# Altium project lan9254.PrjPcb (part 2 of 5)

## Sheet Page 04-LAN9254-Part1.SchDoc
size 416 x 264 mm; DrawnBy: Xuelu Li; Engineer: Parthiv/Xuelu; DocumentNumber: 4; Revision: A0; SheetNumber: 4; SheetTotal: 8; PageSetup: Record=PageOptions|CenterHorizontal=True|CenterVertical=True|PrintScale=1.02|XCorrection=1.00|YCorrection=1.00|PrintKind=0|BorderSize=5000000|LeftOffset=0|BottomOffset=0|Orientation=2|PaperLength=1000|PaperWidth=1000|Scale=100|PaperSource=15|PrintQuality=600|MediaType=1|DitherType=10|PrintScaleMode=1|PaperKind=11x17|PaperIndex=17; PageTitle: LAN9254-Page1; ProjName: EVB-LAN9254-DIGIO; DesignDescription: LAN9254 Evaluation Board; Designer: Xuelu Li; PartNumber: EVB-LAN9254-DIGIO; Sheet1Title: LAN9254-Page1; DocumentFullPathAndName: //depot_np_hweng_boards/ung_hweng/UNG_8017_EVB-USB5926/; ProjectName: lan9254.PrjPcb
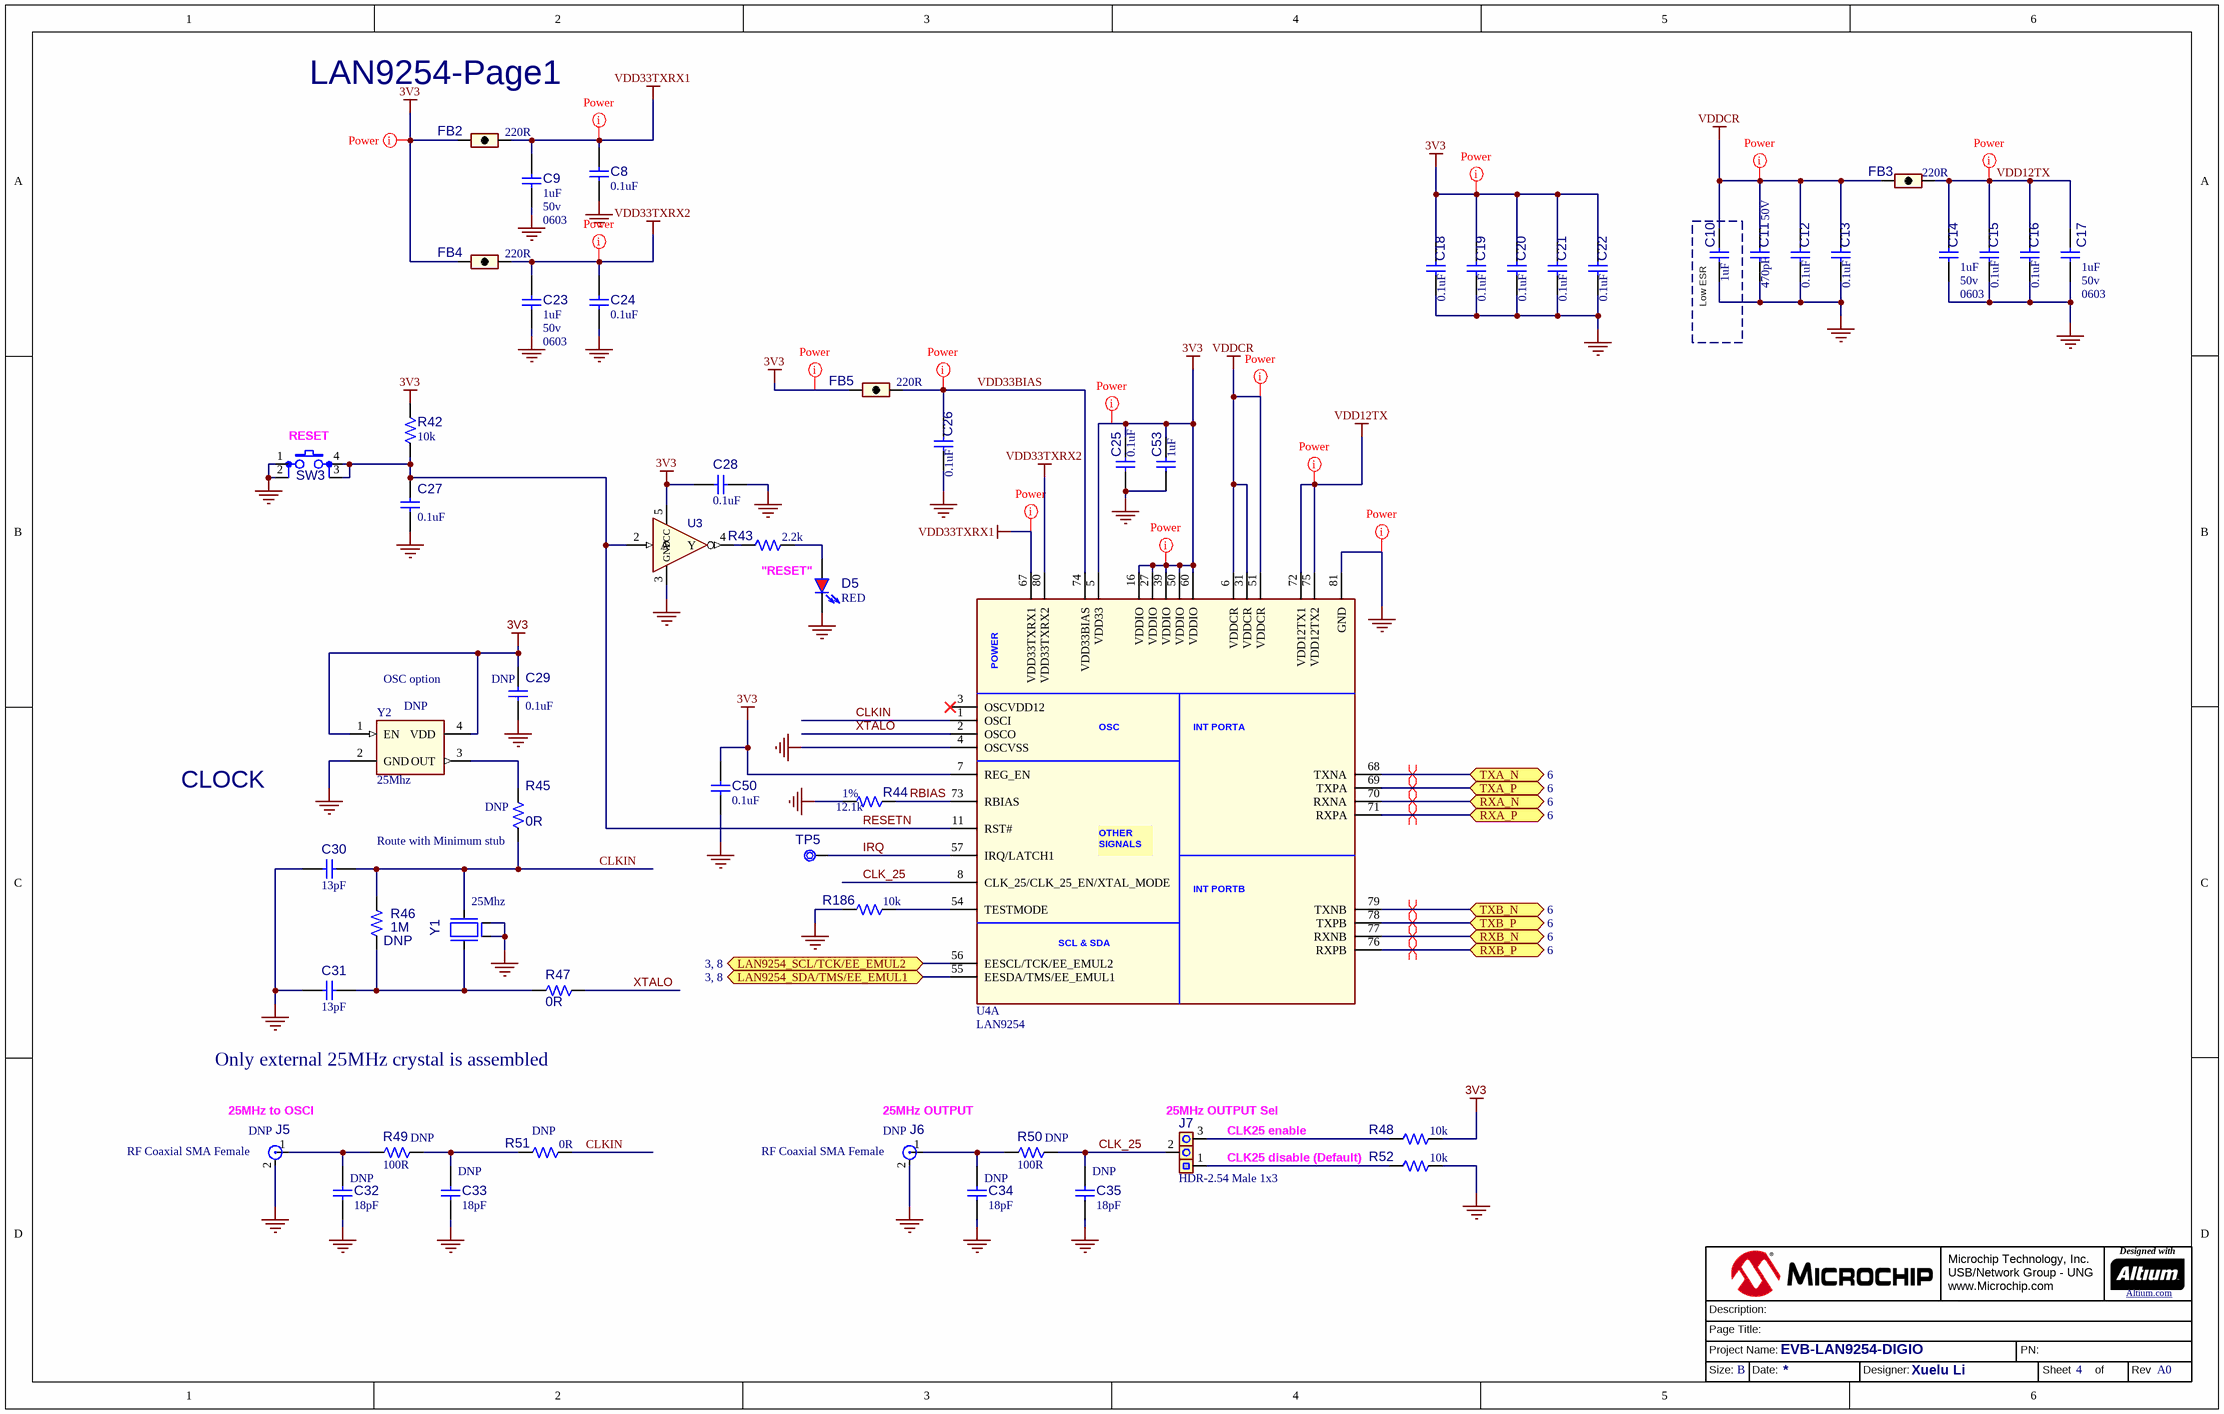
[diagram p3: Page 04-LAN9254-Part1.SchDoc]

### Parts
(Parts that share a designator on the sheet are numbered #1, #2 ... from top to bottom, then left to right.)
?#4  (no value)  (graphical)
C8  value 0.1uF  [CAP_C_0402]  (hidden comment: Capacitor NP)
C9  value 1uF  Voltage: 50v  Package: 0603  [CAP_C_0603]  (hidden comment: Capacitor NP)
C10  value 1uF  [CAP_C_0603]  (hidden comment: Capacitor NP)
C11  value 470pF  Voltage: 50V  [CAP_C_0402]  (hidden comment: Capacitor NP)
C12  value 0.1uF  [CAP_C_0402]  (hidden comment: Capacitor NP)
C13  value 0.1uF  [CAP_C_0402]  (hidden comment: Capacitor NP)
C14  value 1uF  Voltage: 50v  Package: 0603  [CAP_C_0603]  (hidden comment: Capacitor NP)
C15  value 0.1uF  [CAP_C_0402]  (hidden comment: Capacitor NP)
C16  value 0.1uF  [CAP_C_0402]  (hidden comment: Capacitor NP)
C17  value 1uF  Voltage: 50v  Package: 0603  [CAP_C_0603]  (hidden comment: Capacitor NP)
C18  value 0.1uF  [CAP_C_0402]  (hidden comment: Capacitor NP)
C19  value 0.1uF  [CAP_C_0402]  (hidden comment: Capacitor NP)
C20  value 0.1uF  [CAP_C_0402]  (hidden comment: Capacitor NP)
C21  value 0.1uF  [CAP_C_0402]  (hidden comment: Capacitor NP)
C22  value 0.1uF  [CAP_C_0402]  (hidden comment: Capacitor NP)
C23  value 1uF  Voltage: 50v  Package: 0603  [CAP_C_0603]  (hidden comment: Capacitor NP)
C24  value 0.1uF  [CAP_C_0402]  (hidden comment: Capacitor NP)
C25  value 0.1uF  [CAP_C_0402]  (hidden comment: Capacitor NP)
C26  value 0.1uF  [CAP_C_0402]  (hidden comment: Capacitor NP)
C27  value 0.1uF  [CAP_C_0402]  (hidden comment: Capacitor NP)
C28  value 0.1uF  [CAP_C_0402]  (hidden comment: Capacitor NP)
C29  value 0.1uF  Populated: DNP  [CAP_C_0402]  (hidden comment: Capacitor NP)
C30  value 13pF  [CAP_C_0603]  (hidden comment: Capacitor NP)
C31  value 13pF  [CAP_C_0603]  (hidden comment: Capacitor NP)
C32  value 18pF  Populated: DNP  [CAP_C_0805]  (hidden comment: Capacitor NP)
C33  value 18pF  Populated: DNP  [CAP_C_0805]  (hidden comment: Capacitor NP)
C34  value 18pF  Populated: DNP  [CAP_C_0805]  (hidden comment: Capacitor NP)
C35  value 18pF  Populated: DNP  [CAP_C_0805]  (hidden comment: Capacitor NP)
C50  value 0.1uF  [CAP_C_0402]  (hidden comment: Capacitor NP)
C53  value 1uF  [CAP_C_0603]  (hidden comment: Capacitor NP)
D5  value RED  [LED_0603_RED]  (hidden comment: LED_red)
FB2  value 220R  [IND_C_0603]  (hidden comment: Ferrite Bead)
FB3  value 220R  [IND_C_0603]  (hidden comment: Ferrite Bead)
FB4  value 220R  [IND_C_0603]  (hidden comment: Ferrite Bead)
FB5  value 220R  [IND_C_0603]  (hidden comment: Ferrite Bead)
J5  value RF Coaxial SMA Female  Populated: DNP  [CON_JACK_F_TH_V_ACP_901-144-8RFX]  (hidden comment: CON Jack 2 Pins)
J6  value RF Coaxial SMA Female  Populated: DNP  [CON_JACK_F_TH_V_ACP_901-144-8RFX]  (hidden comment: CON Jack 2 Pins)
J7  value HDR-2.54 Male 1x3  [HDR_M_2.54_1x3]  (hidden comment: Header 1x3)
R42  value 10k  [RES_C_0603]  (hidden comment: Resistor)
R43  value 2.2k  [RES_C_0603]  (hidden comment: Resistor)
R44  value 12.1k  Tolerance: 1%  [RES_C_0603]  (hidden comment: Resistor)
R45  value 0R  Populate: DNP  [RES_C_0603]  (hidden comment: Resistor)
R46  value 1M  Populated: DNP  [RES_C_0603]  (hidden comment: Resistor)
R47  value 0R  [RES_C_0603]  (hidden comment: Resistor)
R48  value 10k  [RES_C_0603]  (hidden comment: Resistor)
R49  value 100R  Populated: DNP  [RES_C_0805]  (hidden comment: Resistor)
R50  value 100R  Populated: DNP  [RES_C_0805]  (hidden comment: Resistor)
R51  value 0R  Populated: DNP  [RES_C_0402]  (hidden comment: Resistor)
R52  value 10k  [RES_C_0603]  (hidden comment: Resistor)
R186  value 10k  [RES_C_0603]  (hidden comment: Resistor)
SW3  Switch 4 Pin  [SW_TACT_SMD_CK_PTS810SJM]  (value not drawn)
TP5  Test Point No BOM  [TP_1.2x0.7]  (value not drawn)  (no BOM)
U3  74AHC1G14 SC-70-5  [SC-70-5]  (value not drawn)
U4  value LAN9254  [TQFP-80_12x12_EP6x6]  (hidden comment: LAN9254-SVB TQFP80)  (part A of 2)
Y1  value 25Mhz  [CRYSTAL_XRCGB_L2W1.6H0.7]  (hidden comment: Crystal 4 Pins)
Y2  value 25Mhz  Populated: DNP  [OSCILLATOR_KC2520B-C1]  (hidden comment: OSCILLATOR 4 Pins)

### Blocks framed on the sheet
Low ESR: C10

### Ports
LAN9254_SCL/TCK/EE_EMUL2 (bidir, see 3, 8), LAN9254_SDA/TMS/EE_EMUL1 (bidir, see 3, 8), RXA_N (bidir, see 6), RXA_P (bidir, see 6), RXB_N (bidir, see 6), RXB_P (bidir, see 6), TXA_N (bidir, see 6), TXA_P (bidir, see 6), TXB_N (bidir, see 6), TXB_P (bidir, see 6)

### Nets
3V3: C18.2 C19.2 C20.2 C21.2 C22.2 C25.2 C28.2 C29.2 C50.1 C53.2 FB2.1 FB4.1 FB5.1 R42.1 R48.1 U3.5(VCC) U4.5(VDD33) U4.7(REG_EN) U4.16(VDDIO) U4.27(VDDIO) U4.39(VDDIO) U4.50(VDDIO) U4.60(VDDIO) Y2.1(EN) Y2.4(VDD)
GND: C8.2 C9.1 C10.1 C11.1 C12.1 C13.1 C14.1 C15.1 C16.1 C17.1 C18.1 C19.1 C20.1 C21.1 C22.1 C23.1 C24.2 C25.1 C26.1 C27.1 C28.1 C29.1 C30.1 C31.1 C32.1 C33.1 C34.1 C35.1 C50.2 C53.1 D5.2(K) J5.2 J6.2 R44.1 R52.1 R186.2 SW3.1 SW3.2 U3.3(GND) U4.4(OSCVSS) U4.81(GND) Y1.2(GND) Y1.4(GND) Y2.2(GND)
VDD12TX: C14.2 C15.2 C16.2 C17.2 FB3.2 U4.72(VDD12TX1) U4.75(VDD12TX2)
VDD33TXRX1: C8.1 C9.2 FB2.2 U4.67(VDD33TXRX1)
VDD33TXRX2: C23.2 C24.1 FB4.2 U4.80(VDD33TXRX2)
VDDCR: C10.2 C11.2 C12.2 C13.2 FB3.1 U4.6(VDDCR) U4.31(VDDCR) U4.51(VDDCR)
CLK_25: C35.2 J7.2 R50.2 U4.8(CLK_25/CLK_25_EN/XTAL_MODE)
CLKIN: C30.2 R45.1 R46.2 R51.2 U4.1(OSCI) Y1.3(Osc2)
IRQ: TP5.1 U4.57(IRQ/LATCH1)
LAN9254_SCL/TCK/EE_EMUL2: U4.56(EESCL/TCK/EE_EMUL2) ; port LAN9254_SCL/TCK/EE_EMUL2
LAN9254_SDA/TMS/EE_EMUL1: U4.55(EESDA/TMS/EE_EMUL1) ; port LAN9254_SDA/TMS/EE_EMUL1
RBIAS: R44.2 U4.73(RBIAS)
RESETN: C27.2 R42.2 SW3.3 SW3.4 U3.2(A) U4.11(RST#)
RXA_N: U4.70(RXNA) ; port RXA_N
RXA_P: U4.71(RXPA) ; port RXA_P
RXB_N: U4.77(RXNB) ; port RXB_N
RXB_P: U4.76(RXPB) ; port RXB_P
TXA_N: U4.68(TXNA) ; port TXA_N
TXA_P: U4.69(TXPA) ; port TXA_P
TXB_N: U4.79(TXNB) ; port TXB_N
TXB_P: U4.78(TXPB) ; port TXB_P
VDD33BIAS: C26.2 FB5.2 U4.74(VDD33BIAS)
XTALO: R47.1 U4.2(OSCO)
NetC31_2: C31.2 R46.1 R47.2 Y1.1(Osc1)
NetC32_2: C32.2 J5.1 R49.1
NetC33_2: C33.2 R49.2 R51.1
NetC34_2: C34.2 J6.1 R50.1
NetD5_1: D5.1(A) R43.1
NetJ7_1: J7.1 R52.2
NetJ7_3: J7.3 R48.2
NetR43_2: R43.2 U3.4(Y)
NetR45_2: R45.2 Y2.3(OUT)
NetR186_1: R186.1 U4.54(TESTMODE)

Not connected (* = marked no-connect by the designer): U3 1(NC); U4 3(OSCVDD12)*

### Layout directives
net class Power: 3V3, GND, VDD12TX, VDD33BIAS, VDD33TXRX1, VDD33TXRX2, VDDCR
differential pair; net class Enet: RXA_N, RXA_P, RXB_N, RXB_P, TXA_N, TXA_P, TXB_N, TXB_P

### Notes on the sheet
- (near SW3) RESET
- "RESET"
- OSC option
- CLOCK
- (near R45) Route with Minimum stub
- Only external 25MHz crystal is assembled
- (near J5) 25MHz to OSCI
- (near J6) 25MHz OUTPUT
- (near J7) 25MHz OUTPUT Sel
- CLK25 disable (Default)
- (near J7) CLK25 enable
- Microchip Technology, Inc.
  USB/Network Group - UNG
  www.Microchip.com
- Designed with
- Altium.com <http://go.altium.com/MicrochipLandingPage_Evaluation.html>
- Page Title:
- Project Name:
- Description:
- PN:
- Size:
- B
- Date:
- Designer:
- Sheet
- of
- Rev
- (in symbol MIC8841, part A) POWER; OSC; INT PORTA; OTHER / SIGNALS; INT PORTB; SCL & SDA

### Library data of the parts
?#4 = Title Block B_UNG1_Altium
C8 C24 C27 C28 C50 = CAP1033: Capacitor; Manufacturer 1: Murata; Manufacturer Part Number 1: GRM155R71C104KA88D; Voltage: 16V; Description_: CAP CER 0.1uF 16V 10% X7R SMD 0402; Tolerance: 10%; Temperature Coeffcient: X7R; Type: Ceramic; Owner: Sompoch Loboonlert; Populated: Yes; MCHP-ID: CAP1033; Package: 0402; Revision: 2; Status: Production; ComponentLink1URL: https://chn-vm-apps.microchip.com/mchprepo/parts/Datasheets/L0005E.pdf; ComponentLink1Description: Datasheet; Operating Temperature: -55C to +125C; Category: Capacitor; Supplier 1: Digi-Key; Supplier Part Number 1: 490-3261-2-ND; Quantity Override: 1
C9 C14 C17 C23 = CAP1764: Capacitor; Manufacturer 1: Taiyo Yuden; Manufacturer Part Number 1: UMK107AB7105KA-T; Description_: CAP CER 1uF 50V 10% X7R SMD 0603; Dev Tools Status: Production; Tolerance: 10%; Temperature Coeffcient: X7R; Type: Ceramic; Owner: Sam Charles; Populated: YES; MCHP-ID: CAP1764; Revision: 1; Symbol: Capacitor NP; Status: MCL Design; ComponentLink1URL: https://chn-vm-apps.microchip.com/mchprepo/parts/Datasheets/UMK107AB7105KA-T_SS.pdf; ComponentLink1Description: SVN Datasheet; ComponentLink2URL: C:\ALTIUM_WORK\00001_MCHP-CDB\Datasheets\UMK107AB7105KA-T_SS.pdf; ComponentLink2Description: Local Datasheet; ComponentLink3URL: C:\ALTIUM_WORK\00001_MCHP-CDB\Library\LibraryRefs\Capacitor NP.SchLib; ComponentLink3Description: Open Symbol; ComponentLink4URL: C:\ALTIUM_WORK\00001_MCHP-CDB\Library\Footprints\CAP_C_0603.PcbLib; ComponentLink4Description: Open Footprint; ComponentLink5Description: Open Footprint 2; ComponentLink6Description: Open Footprint 3; ComponentLink7Description: Open Footprint 4; Operating Temperature: -55°C ~ 125°C; Category: Capacitor; Supplier 1: Digi-Key; Supplier Part Number 1: 587-3247-1-ND; Quantity Override: 1
C10 C53 = CAP0638: Capacitor; Manufacturer 1: Taiyo Yuden; Manufacturer Part Number 1: LMK107BJ105KA-T; Voltage: 50V; Description_: CAP CER 1uF 50V 10% X5R SMD 0603; Tolerance: 10%; Temperature Coeffcient: X5R; Type: Ceramic; Populated: Yes; MCHP-ID: CAP0638; Package: 0603; Revision: 1; Status: Production; ComponentLink1URL: https://chn-vm-apps.microchip.com/mchprepo/parts/Datasheets/mlcc01_e.pdf; ComponentLink1Description: Datasheet; Operating Temperature: -55C to +85C; Category: Capacitor; Supplier 1: Digi-Key; Supplier Part Number 1: 587-2400-1-ND; Quantity Override: 1
C11 = CAP1382: Capacitor; Manufacturer 1: Murata; Manufacturer Part Number 1: GRM1555C1H471JA01D; Description_: CAP CER 470pF 50V 5% NP0 SMD 0402; Dev Tools Status: Production; Tolerance: 5%; Temperature Coeffcient: NP0; Type: Ceramic; Owner: Duane Burt; Populated: YES; MCHP-ID: CAP1382; Revision: 1; Symbol: Capacitor NP; Status: MCL Design; ComponentLink1URL: https://chn-vm-apps.microchip.com/mchprepo/parts/Datasheets/c02e.pdf; ComponentLink1Description: SVN Datasheet; ComponentLink2URL: C:\ALTIUM_WORK\00001_MCHP-CDB\Datasheets\c02e.pdf; ComponentLink2Description: Local Datasheet; ComponentLink3URL: C:\ALTIUM_WORK\00001_MCHP-CDB\Library\LibraryRefs\Capacitor NP.SchLib; ComponentLink3Description: Open Symbol; ComponentLink4URL: C:\ALTIUM_WORK\00001_MCHP-CDB\Library\Footprints\CAP_C_0402.PcbLib; ComponentLink4Description: Open Footprint; ComponentLink5Description: Open Footprint 2; ComponentLink6Description: Open Footprint 3; ComponentLink7Description: Open Footprint 4; Operating Temperature: -55C to +125C; Category: Capacitor; Supplier 1: Digikey; Supplier Part Number 1: 490-1297-1-ND; Quantity Override: 1
C12 C13 C15 C16 C18-C22 C25 C26 = CAP1463: Capacitor; Manufacturer 1: Taiyo Yuden; Manufacturer Part Number 1: UMK105B7104KV-FR; Description_: CAP CER 0.1uF 50V 10% X7R SMD 0402; Dev Tools Status: Production; Tolerance: 10%; Temperature Coeffcient: X7R; Type: Ceramic; Owner: Jamus Griego; Populated: YES; MCHP-ID: CAP1463; Revision: 1; Symbol: Capacitor NP; Status: MCL Design; ComponentLink1URL: https://chn-vm-apps.microchip.com/mchprepo/parts/Datasheets/TDKMLCCCapRange.pdf; ComponentLink1Description: SVN Datasheet; ComponentLink2URL: C:\ALTIUM_WORK\00001_MCHP-CDB\Datasheets\TDKMLCCCapRange.pdf; ComponentLink2Description: Local Datasheet; ComponentLink3URL: C:\ALTIUM_WORK\00001_MCHP-CDB\Library\LibraryRefs\Capacitor NP.SchLib; ComponentLink3Description: Open Symbol; ComponentLink4URL: C:\ALTIUM_WORK\00001_MCHP-CDB\Library\Footprints\CAP_C_0402.PcbLib; ComponentLink4Description: Open Footprint; ComponentLink5Description: Open Footprint 2; ComponentLink6Description: Open Footprint 3; ComponentLink7Description: Open Footprint 4; Operating Temperature: -55C to +125C; Category: Capacitor; Manufacturer 2: TDK Corporation; Manufacturer Part Number 2: C1005X7R1H104K050BB; Supplier 1: Digi-Key; Supplier Part Number 1: 587-3498-1-ND; Supplier 2: Digi-Key; Supplier Part Number 2: 445-5932-1-ND; Quantity Override: 1
C29 = CAP1033: Capacitor; Manufacturer 1: Murata; Manufacturer Part Number 1: GRM155R71C104KA88D; Voltage: 16V; Description_: CAP CER 0.1uF 16V 10% X7R SMD 0402; Tolerance: 10%; Temperature Coeffcient: X7R; Type: Ceramic; Owner: Sompoch Loboonlert; DNP: Yes; MCHP-ID: CAP1033; Package: 0402; Revision: 2; Status: Production; ComponentLink1URL: https://chn-vm-apps.microchip.com/mchprepo/parts/Datasheets/L0005E.pdf; ComponentLink1Description: Datasheet; Operating Temperature: -55C to +125C; Category: Capacitor; Supplier 1: Digi-Key; Supplier Part Number 1: 490-3261-2-ND; Quantity Override: 1
C30 C31 = CAP1458: Capacitor; Manufacturer 1: Murata Electronics North America; Manufacturer Part Number 1: GRM1885C1H130JA01D; Voltage: 50V; Description_: CAP CER 13pF 50V 5% NP0 SMD 0603; Dev Tools Status: Production; Tolerance: 5%; Temperature Coeffcient: NP0; Type: Ceramic; Owner: Jamus Griego; Populated: YES; MCHP-ID: CAP1458; Package: 0603; Revision: 1; Symbol: Capacitor NP; Status: MCL Design; ComponentLink1URL: https://chn-vm-apps.microchip.com/mchprepo/parts/Datasheets/partnumbering_e_01.pdf; ComponentLink1Description: SVN Datasheet; ComponentLink2URL: C:\ALTIUM_WORK\00001_MCHP-CDB\Datasheets\partnumbering_e_01.pdf; ComponentLink2Description: Local Datasheet; ComponentLink3URL: C:\ALTIUM_WORK\00001_MCHP-CDB\Library\LibraryRefs\Capacitor NP.SchLib; ComponentLink3Description: Open Symbol; ComponentLink4URL: C:\ALTIUM_WORK\00001_MCHP-CDB\Library\Footprints\CAP_C_0603.PcbLib; ComponentLink4Description: Open Footprint; ComponentLink5Description: Open Footprint 2; ComponentLink6Description: Open Footprint 3; ComponentLink7Description: Open Footprint 4; Operating Temperature: -55C to +125C; Category: Capacitor; Supplier 1: Digi-Key; Supplier Part Number 1: 490-1406-1-ND; Quantity Override: 1
C32-C35 = CAP0158: Capacitor; Manufacturer 1: Cal-Chip; Manufacturer Part Number 1: GMC21CG180J50NTLF; Voltage: 50V; Description_: CAP CER 18pF 50V 5% NP0 SMD 0805; Dev Tools Status: Production; Tolerance: 5%; Temperature Coeffcient: NP0; Type: Ceramic; MCHP-ID: CAP0158; Package: 0805; Revision: 2; Symbol: Capacitor NP; Status: MCL Design; ComponentLink1URL: https://chn-vm-apps.microchip.com/mchprepo/parts/Datasheets/XC-600124.pdf; ComponentLink1Description: SVN Datasheet; ComponentLink2URL: C:\ALTIUM_WORK\00001_MCHP-CDB\Datasheets\XC-600124.pdf; ComponentLink2Description: Local Datasheet; ComponentLink3URL: C:\ALTIUM_WORK\00001_MCHP-CDB\Library\LibraryRefs\Capacitor NP.SchLib; ComponentLink3Description: Open Symbol; ComponentLink4URL: C:\ALTIUM_WORK\00001_MCHP-CDB\Library\Footprints\CAP_C_0805.PcbLib; ComponentLink4Description: Open Footprint; ComponentLink5Description: Open Footprint 2; ComponentLink6Description: Open Footprint 3; ComponentLink7Description: Open Footprint 4; Operating Temperature: -55C to +125C; Category: Capacitor; Manufacturer 2: Panasonic; Manufacturer Part Number 2: ECJ-2VC1H180J; Manufacturer 3: Xicon; Manufacturer Part Number 3: CC501N180J; Manufacturer 4: NIC Components; Manufacturer Part Number 4: NMC0805NPO180J50TRPF; Manufacturer 5: Yageo; Manufacturer Part Number 5: CC0805JRNPO9BN180; Supplier 1: Cal-Chip; Supplier Part Number 1: GMC21CG180J50NTLF; Supplier 2: Digi-Key; Supplier Part Number 2: PCC180CNCT-ND; Supplier 3: Mouser; Supplier Part Number 3: CAP0158; Supplier 4: NIC Components; Supplier Part Number 4: NMC0805NPO180J50TRPF; Supplier 5: Digi-Key; Supplier Part Number 5: 311-1102-1-ND; Quantity Override: 1
D5 = LED1073: LED; Manufacturer 1: Lite-On Inc.; Manufacturer Part Number 1: LTST-C191KRKT; Description_: DIO RED 2V 20mA 54mcd CLEAR SMD 0603; Dev Tools Status: Production; Type: LED Single; Forward Current: 20mA; Owner: Sompoch Loboonlert; Populated: YES; MCHP-ID: LED1073; Revision: 2; Symbol: LED_RED; Status: MCL Design; Package: 0603; ComponentLink1URL: https://chn-vm-apps.microchip.com/mchprepo/parts/Datasheets/LTST-C191KRKT.PDF; ComponentLink1Description: SVN Datasheet; ComponentLink2URL: C:\ALTIUM_WORK\00001_MCHP-CDB\Datasheets\LTST-C191KRKT.PDF; ComponentLink2Description: Local Datasheet; ComponentLink3URL: C:\ALTIUM_WORK\00001_MCHP-CDB\Library\LibraryRefs\LED_RED.SchLib; ComponentLink3Description: Open Symbol; ComponentLink4URL: C:\ALTIUM_WORK\00001_MCHP-CDB\Library\Footprints\LED_0603_RED.PcbLib; ComponentLink4Description: Open Footprint; ComponentLink5Description: Open Footprint 2; ComponentLink6Description: Open Footprint 3; ComponentLink7Description: Open Footprint 4; Category: Diode; Supplier 1: Digi-Key; Supplier Part Number 1: 160-1447-1-ND; Quantity Override: 1
FB2 FB4 FB5 = IND1025: Manufacturer 1: Murata; Manufacturer Part Number 1: BLM18AG221SN1D; Description_: FERRITE 500mA 220R SMD 0603; Dev Tools Status: Production; Owner: Sompoch Loboonlert; RMS Current: 500ma; Test Frequency: 100 MHz; Populated: YES; MCHP-ID: IND1025; Revision: 1; Symbol: Ferrite Bead; Status: MCL Design; ComponentLink1URL: https://chn-vm-apps.microchip.com/mchprepo/parts/Datasheets/L0110S0100BLM18A.pdf; ComponentLink1Description: Datasheet; Package: SMD; Type: Ferrite Bead; Category: Inductor; Supplier 1: Digi-Key; Supplier Part Number 1: 490-1012-1-ND; Quantity Override: 1
FB3 = IND1549: Manufacturer 1: Murata Electronics North America; Manufacturer Part Number 1: BLM18PG221SN1D; Description_: FERRITE 220R@100MHz 1.4A SMD 0603; Dev Tools Status: Production; Owner: Ciprian Abramov; DCR: 0.1R; Saturation Current: 1.4A; Test Frequency: 100MHz; Populated: YES; MCHP-ID: IND1549; Revision: 1; Symbol: Ferrite Bead; Status: MCL Design; ComponentLink1URL: https://chn-vm-apps.microchip.com/mchprepo/parts/Datasheets/ENFA0003.pdf; ComponentLink1Description: SVN Datasheet; ComponentLink2URL: C:\ALTIUM_WORK\00001_MCHP-CDB\Datasheets\ENFA0003.pdf; ComponentLink2Description: Local Datasheet; ComponentLink3URL: C:\ALTIUM_WORK\00001_MCHP-CDB\Library\LibraryRefs\Ferrite Bead.SchLib; ComponentLink3Description: Open Symbol; ComponentLink4URL: C:\ALTIUM_WORK\00001_MCHP-CDB\Library\Footprints\IND_C_0603.PcbLib; ComponentLink4Description: Open Footprint; ComponentLink5Description: Open Footprint 2; ComponentLink6Description: Open Footprint 3; ComponentLink7Description: Open Footprint 4; Operating Temperature: -55C to +125C; Package: 0603; Type: Ferrite Bead; Category: Inductor; RMS Current: 1.4A; Supplier 1: Digi-Key; Supplier Part Number 1: 490-5221-1-ND; Quantity Override: 1
J5 J6 = CON1224: Manufacturer 1: TE Connectivity; Manufacturer Part Number 1: 5-1814832-1; Description_: CON RF Coaxial SMA Female 2P TH VERT; Dev Tools Status: Production; Owner: Jairuz Agang-ang; MCHP-ID: CON1224; Revision: 0; Symbol: CON Jack 2 Pins; Status: MCL Design; ComponentLink1URL: https://chn-vm-apps.microchip.com/mchprepo/parts/Datasheets/C901-144-8RFX.pdf; ComponentLink1Description: SVN Datasheet; ComponentLink2URL: C:\ALTIUM_WORK\00001_MCHP-CDB\Datasheets\C901-144-8RFX.pdf; ComponentLink2Description: Local Datasheet; ComponentLink3URL: C:\ALTIUM_WORK\00001_MCHP-CDB\Library\LibraryRefs\CON Jack 2 Pins.SchLib; ComponentLink3Description: Open Symbol; ComponentLink4URL: C:\ALTIUM_WORK\00001_MCHP-CDB\Library\Footprints\CON_JACK_F_TH_V_ACP_901-144-8RFX.PcbLib; ComponentLink4Description: Open Footprint; ComponentLink5Description: Open Footprint 2; ComponentLink6Description: Open Footprint 3; ComponentLink7Description: Open Footprint 4; Type: RF; Category: Connector; Manufacturer 2: Amphenol Commercial Products; Manufacturer Part Number 2: 901-144-8RFX; Supplier 1: Digi-Key; Supplier Part Number 1: A97594-ND; Supplier 2: Digi-Key; Supplier Part Number 2: ARFX1231-ND; Quantity Override: 1
J7 = CON0465: Manufacturer 1: Samtec; Manufacturer Part Number 1: TSW-103-07-T-S; Description_: CON HDR-2.54 Male 1x3 Tin 5.84MH TH VERT; Dev Tools Status: Production; Populated: Yes; MCHP-ID: CON0465; Revision: 1; Symbol: Header 1x3; Status: MCL Design; ComponentLink1URL: https://chn-vm-apps.microchip.com/mchprepo/parts/Datasheets/TSW-XXX-XX-XXX-X-XX-XXX-MKT.pdf; ComponentLink1Description: SVN Datasheet; ComponentLink2URL: C:\ALTIUM_WORK\00001_MCHP-CDB\Datasheets\TSW-XXX-XX-XXX-X-XX-XXX-MKT.pdf; ComponentLink2Description: Local Datasheet; ComponentLink3URL: C:\ALTIUM_WORK\00001_MCHP-CDB\Library\LibraryRefs\Header 1x3.SchLib; ComponentLink3Description: Open Symbol; ComponentLink4URL: C:\ALTIUM_WORK\00001_MCHP-CDB\Library\Footprints\HDR_M_2.54_1x3.PcbLib; ComponentLink4Description: Open Footprint; ComponentLink5Description: Open Footprint 2; ComponentLink6Description: Open Footprint 3; ComponentLink7Description: Open Footprint 4; Type: Header 2.54mm; Category: Connector; Manufacturer 2: SHENZHEN JUNHAO ENGINEERING; Manufacturer Part Number 2: R-211-0311-0021-000; Supplier 1: Digi-Key; Supplier Part Number 1: SAM1035-03-ND; Supplier 2: Raynen; Supplier Part Number 2: CONN00253B01; Quantity Override: 1
R42 = RSMT0625: Manufacturer 1: Vishay; Manufacturer Part Number 1: CRCW060310K0FKEA; Tolerance: 1%; Description_: RES TKF 10k 1% 1/10W SMD 0603; Voltage: 75V; Temperature Coeffcient: 100ppm/C; Power: 1/10W; Populated: Yes; MCHP-ID: RSMT0625; Package: 0603; Revision: 1; Status: Production; ComponentLink1URL: https://chn-vm-apps.microchip.com/mchprepo/parts/Datasheets/dcrcwe3.pdf; ComponentLink1Description: Datasheet; Operating Temperature: -55C to +155C; Category: Resistor; Type: RES SMD; Composition: TKF; Manufacturer 2: ROHM; Manufacturer Part Number 2: MCR03EZPFX1002; Supplier 1: Digi-Key; Supplier Part Number 1: 541-10.0KHCT-ND; Supplier 2: Digi-Key; Supplier Part Number 2: RHM10.0KHCT-ND; Quantity Override: 1
R43 = RES1130: Manufacturer 1: Panasonic; Manufacturer Part Number 1: ERJ-3EKF2201V; Tolerance: 1%; Description_: RES TKF 2.2k 1% 1/10W SMD 0603; Voltage: 75V; Temperature Coeffcient: 100ppm/C; Power: 1/10W; Owner: Bogdan P (M91398); Populated: Yes; MCHP-ID: RES1130; Package: 0603; Revision: 0; Status: Production; ComponentLink1URL: https://chn-vm-apps.microchip.com/mchprepo/parts/Datasheets/AOA0000CE2.pdf; ComponentLink1Description: Datasheet; Operating Temperature: -55C to +155C; Category: Resistor; Type: RES SMD; Composition: TKF; Supplier 1: Digi-Key; Supplier Part Number 1: P2.20KHCT-ND; Quantity Override: 1
R44 = RSMT0414: Manufacturer 1: Panasonic; Manufacturer Part Number 1: ERJ-3EKF1212V; Description_: RES TKF 12.1k 1% 1/10W SMD 0603; Dev Tools Status: Production; Voltage: 75V; Temperature Coeffcient: 100ppm/C; Power: 1/10W; Populated: Yes; MCHP-ID: RSMT0414; Revision: 1; Symbol: Resistor; Status: MCL Design; ComponentLink1URL: https://chn-vm-apps.microchip.com/mchprepo/parts/Datasheets/AOA0000CE2.pdf; ComponentLink1Description: SVN Datasheet; ComponentLink2URL: C:\ALTIUM_WORK\00001_MCHP-CDB\Datasheets\AOA0000CE2.pdf; ComponentLink2Description: Local Datasheet; ComponentLink3URL: C:\ALTIUM_WORK\00001_MCHP-CDB\Library\LibraryRefs\Resistor.SchLib; ComponentLink3Description: Open Symbol; ComponentLink4URL: C:\ALTIUM_WORK\00001_MCHP-CDB\Library\Footprints\RES_C_0603.PcbLib; ComponentLink4Description: Open Footprint; ComponentLink5Description: Open Footprint 2; ComponentLink6Description: Open Footprint 3; ComponentLink7Description: Open Footprint 4; Operating Temperature: -55C to +155C; Category: Resistor; Type: RES SMD; Composition: TKF; Manufacturer 2: ROHM; Manufacturer Part Number 2: MCR03EZPFX1212; Manufacturer 3: SET; Manufacturer Part Number 3: RMCF1/1612.1K1%TR; Supplier 1: Digi-Key; Supplier Part Number 1: P12.1KHCT-ND; Supplier 2: Digi-Key; Supplier Part Number 2: RHM12.1KHCT-ND; Supplier 3: SET; Supplier Part Number 3: RMCF1/1612.1K1%TR; Quantity Override: 1
R45 R47 = RSMT0001: RES TKF 0R 1/10W SMD 0603; Manufacturer 1: NIC Components; Manufacturer Part Number 1: NRC06Z0TRF; Populated: Yes; MCHP-ID: RSMT0001; Package: 0603; Revision: 2; Description_: RES TKF 0R 1/10W SMD 0603; Status: Production; ComponentLink1URL: https://chn-vm-apps.microchip.com/mchprepo/parts/Datasheets/nrc.pdf; ComponentLink1Description: Datasheet; Operating Temperature: -55C to +155C; Category: Resistor; Type: RES SMD; Composition: TKF; Power: 1/10W; Manufacturer 2: Panasonic; Manufacturer Part Number 2: ERJ-3GSY0R00V; Manufacturer 3: Panasonic; Manufacturer Part Number 3: ERJ-3GEY0R00V; Manufacturer 4: Stackpole Electronics Inc; Manufacturer Part Number 4: RMCF0603ZT0R00; Manufacturer 5: Vishay; Manufacturer Part Number 5: CRCW06030000Z0EA; Manufacturer 6: Stackpole Electronics Inc; Manufacturer Part Number 6: RMCF 1/16 0 R; Manufacturer 7: Yageo; Manufacturer Part Number 7: RC0603JR-070RL; Manufacturer 8: KOA Speer; Manufacturer Part Number 8: RK73Z1JTTP; Manufacturer 9: ROHM; Manufacturer Part Number 9: MCR03EZPJ000; Supplier 1: NIC Components; Supplier Part Number 1: NRC06Z0TRF; Supplier 2: Digi-Key; Supplier Part Number 2: P0.0GTR-ND; Supplier 3: Digi-Key; Supplier Part Number 3: RMCF0603ZT0R00TR-ND; Supplier 4: Digi-Key; Supplier Part Number 4: RMCF0603ZT0R00CT-ND; Supplier 5: Digi-Key; Supplier Part Number 5: 541-0.0GCT-ND; Supplier 6: Digi-Key; Supplier Part Number 6: RMCF1/160RTR-ND; Supplier 7: Digi-Key; Supplier Part Number 7: 311-0.0GRCT-ND; Supplier 8: KOA Speer; Supplier Part Number 8: RK73Z1JTTP; Supplier 9: Digi-Key; Supplier Part Number 9: RHM0.0GCT-ND; Quantity Override: 1
R46 = RES1129: RES TKF 1M 1% 1/10W SMD 0603; Manufacturer 1: Panasonic; Manufacturer Part Number 1: ERJ-3EKF1004V; Voltage: 75V; Temperature Coeffcient: 100ppm/C; Owner: Bogdan P (M91398); MCHP-ID: RES1129; Package: 0603; Tolerance: 1%; Revision: 0; Description_: RES TKF 1M 1% 1/10W SMD 0603; Status: Production; ComponentLink1URL: https://chn-vm-apps.microchip.com/mchprepo/parts/Datasheets/AOA0000CE2.pdf; ComponentLink1Description: Datasheet; Operating Temperature: -55C to +155C; Category: Resistor; Type: RES SMD; Composition: TKF; Power: 1/10W; Supplier 1: Digi-Key; Supplier Part Number 1: P1.00MHCT-ND; Quantity Override: 1
R48 R52 R186 = RSMT0139: Manufacturer 1: Panasonic; Manufacturer Part Number 1: ERJ-3EKF1002V; Tolerance: 1%; Description_: RES TKF 10k 1% 1/10W SMD 0603; Dev Tools Status: Production; Temperature Coeffcient: 100ppm/C; Power: 1/10W; Populated: Yes; MCHP-ID: RSMT0139; Package: 0603; Revision: 2; Symbol: Resistor; Status: MCL Design; ComponentLink1URL: https://chn-vm-apps.microchip.com/mchprepo/parts/Datasheets/nrc.pdf; ComponentLink1Description: SVN Datasheet; ComponentLink2URL: C:\ALTIUM_WORK\00001_MCHP-CDB\Datasheets\nrc.pdf; ComponentLink2Description: Local Datasheet; ComponentLink3URL: C:\ALTIUM_WORK\00001_MCHP-CDB\Library\LibraryRefs\Resistor.SchLib; ComponentLink3Description: Open Symbol; ComponentLink4URL: C:\ALTIUM_WORK\00001_MCHP-CDB\Library\Footprints\RES_C_0603.PcbLib; ComponentLink4Description: Open Footprint; ComponentLink5Description: Open Footprint 2; ComponentLink6Description: Open Footprint 3; ComponentLink7Description: Open Footprint 4; Operating Temperature: -55C to +155C; Category: Resistor; Type: RES SMD; Composition: TKF; Manufacturer 2: Stackpole Electronics Inc; Manufacturer Part Number 2: RMCF0603FT10K0; Manufacturer 3: Yageo; Manufacturer Part Number 3: RC0603FR-0710KL; Manufacturer 4: Stackpole Electronics Inc; Manufacturer Part Number 4: RMCF 1/16 10K 1% R; Manufacturer 5: Xicon; Manufacturer Part Number 5: 302-10K-RC; Manufacturer 6: NIC Components; Manufacturer Part Number 6: NRC06F1002TRF; Supplier 1: Digi-Key; Supplier Part Number 1: P10.0KHCT-ND; Supplier 2: Digi-Key; Supplier Part Number 2: RMCF1/1610KFRTR-ND; Supplier 3: Digi-Key; Supplier Part Number 3: 311-10.0KHRCT-ND; Supplier 4: Digi-Key; Supplier Part Number 4: RMCF0603FT10K0TR-ND; Supplier 5: Mouser; Supplier Part Number 5: 302-10k-RC; Supplier 6: NIC Components; Supplier Part Number 6: NRC06F1002TRF; Quantity Override: 1
R49 R50 = RES1375: Manufacturer 1: Panasonic Electronic Components; Manufacturer Part Number 1: ERA-S39J101V; Tolerance: 5%; Description_: RES MF 100R 5% 1/10W SMD 0805; Dev Tools Status: Production; Temperature Coeffcient: 3900ppm/C; Circuit Type: Isolated; Power: 1/10W; Owner: Jairuz Agang-ang; MCHP-ID: RES1375; Package: 0805; Revision: 1; Symbol: Resistor; Status: MCL Design; ComponentLink1URL: https://chn-vm-apps.microchip.com/mchprepo/parts/Datasheets/AOF0000CE1.pdf; ComponentLink1Description: SVN Datasheet; ComponentLink2URL: C:\ALTIUM_WORK\00001_MCHP-CDB\Datasheets\AOF0000CE1.pdf; ComponentLink2Description: Local Datasheet; ComponentLink3URL: C:\ALTIUM_WORK\00001_MCHP-CDB\Library\LibraryRefs\Resistor.SchLib; ComponentLink3Description: Open Symbol; ComponentLink4URL: C:\ALTIUM_WORK\00001_MCHP-CDB\Library\Footprints\RES_C_0805.PcbLib; ComponentLink4Description: Open Footprint; ComponentLink5Description: Open Footprint 2; ComponentLink6Description: Open Footprint 3; ComponentLink7Description: Open Footprint 4; Operating Temperature: -40C to +125C; Category: Resistor; Type: RES SMD; Composition: MF; Supplier 1: Digi-Key; Supplier Part Number 1: P100CECT-ND; Quantity Override: 1
R51 = RSMT1040: Manufacturer 1: Yageo; Manufacturer Part Number 1: RC0402JR-070RL; Description_: RES TKF 0R 1/16W SMD 0402; Dev Tools Status: Production; Power: 1/16W; Owner: Sompoch Loboonlert; MCHP-ID: RSMT1040; Package: 0402; Revision: 2; Symbol: Resistor; Status: MCL Design; ComponentLink1URL: https://chn-vm-apps.microchip.com/mchprepo/parts/Datasheets/PYu-RC0402_51_RoHS_L_6.pdf; ComponentLink1Description: SVN Datasheet; ComponentLink2URL: C:\ALTIUM_WORK\00001_MCHP-CDB\Datasheets\PYu-RC0402_51_RoHS_L_6.pdf; ComponentLink2Description: Local Datasheet; ComponentLink3URL: C:\ALTIUM_WORK\00001_MCHP-CDB\Library\LibraryRefs\Resistor.SchLib; ComponentLink3Description: Open Symbol; ComponentLink4URL: C:\ALTIUM_WORK\00001_MCHP-CDB\Library\Footprints\RES_C_0402.PcbLib; ComponentLink4Description: Open Footprint; ComponentLink5Description: Open Footprint 2; ComponentLink6Description: Open Footprint 3; ComponentLink7Description: Open Footprint 4; Operating Temperature: -55C to +155C; Category: Resistor; Type: RES SMD; Composition: TKF; Supplier 1: Digi-Key; Supplier Part Number 1: 311-0.0JRCT-ND; Quantity Override: 1
SW3 = SWITCH1072: Switch; Manufacturer 1: C&K Components; Manufacturer Part Number 1: PTS810 SJM 250 SMTR LFS; Value: SPST-NO; Description_: SWITCH TACT SPST 16V 50mA  PTS810 SJM 250 SMTR LFS SMD; Dev Tools Status: Design; Owner: Sam Charles; Voltage: 16V; Current: 50mA; Populated: YES; MCHP-ID: SWITCH1072; Revision: B; Symbol: Switch 4 Pin; Status: MCL Design; ComponentLink1URL: https://chn-vm-apps.microchip.com/mchprepo/parts/Datasheets/pts810.pdf; ComponentLink1Description: SVN Datasheet; ComponentLink2URL: C:\ALTIUM_WORK\00001_MCHP-CDB\Datasheets\pts810.pdf; ComponentLink2Description: Local Datasheet; ComponentLink3URL: C:\ALTIUM_WORK\00001_MCHP-CDB\Library\LibraryRefs\Switch 4 Pin.SchLib; ComponentLink3Description: Open Symbol; ComponentLink4URL: C:\ALTIUM_WORK\00001_MCHP-CDB\Library\Footprints\SW_TACT_SMD_CK_PTS810SJM.PcbLib; ComponentLink4Description: Open Footprint; ComponentLink5Description: Open Footprint 2; ComponentLink6Description: Open Footprint 3; ComponentLink7Description: Open Footprint 4; Operating Temperature: -40°C ~ 85°C; Category: Switch; Type: Tactile; Supplier 1: Digi-Key; Supplier Part Number 1: CKN10502CT-ND; Quantity Override: 1
TP5 = CON1128: Test Point; Value: TP PAD PCB 1.2x0.7; Description_: CON TP PAD PCB 1.2x0.7 TH; Dev Tools Status: Production; Owner: Bogdan P (M91398); Populated: Yes; MCHP-ID: CON1128; Revision: 0; Symbol: Test Point No BOM; Status: MCL Design; ComponentLink1Description: SVN Datasheet; ComponentLink2Description: Local Datasheet; ComponentLink3URL: C:\ALTIUM_WORK\00001_MCHP-CDB\Library\LibraryRefs\Test Point No BOM.SchLib; ComponentLink3Description: Open Symbol; ComponentLink4URL: C:\ALTIUM_WORK\00001_MCHP-CDB\Library\Footprints\TP_1.2x0.7.PcbLib; ComponentLink4Description: Open Footprint; ComponentLink5Description: Open Footprint 2; ComponentLink6Description: Open Footprint 3; ComponentLink7Description: Open Footprint 4; Type: Test Point; Category: Connector; Quantity Override: 1
U3 = IC1597: Manufacturer 1: Nexperia; Manufacturer Part Number 1: 74AHC1G14GW,125; MCHP-ID: IC1597; Description_: IC BUFFER Inverting Schmitt trigger 74AHC1G14GW GATE SGL CMOS SC-70-5; Dev Tools Status: Design; Vin: +2V to +5.5V; Owner: Cristian Papuc; Populated: YES; Value: 74AHC1G14; Revision: A; Symbol: 74AHC1G14 SC-70-5; Status: MCL Design; Package: SC-70-5; ComponentLink1URL: https://chn-vm-apps.microchip.com/mchprepo/parts/Datasheets/74AHC_AHCT1G14.pdf; ComponentLink1Description: SVN Datasheet; ComponentLink2URL: C:\ALTIUM_WORK\00001_MCHP-CDB\Datasheets\74AHC_AHCT1G14.pdf; ComponentLink2Description: Local Datasheet; ComponentLink3URL: C:\ALTIUM_WORK\00001_MCHP-CDB\Library\LibraryRefs\74AHC1G14 SC-70-5.SchLib; ComponentLink3Description: Open Symbol; ComponentLink4URL: C:\ALTIUM_WORK\00001_MCHP-CDB\Library\Footprints\SC-70-5.PcbLib; ComponentLink4Description: Open Footprint; ComponentLink5Description: Open Footprint 2; ComponentLink6Description: Open Footprint 3; ComponentLink7Description: Open Footprint 4; Operating Temperature: -40C to +125C; Type: Buffer; Category: IC; Supplier 1: Digi-Key; Supplier Part Number 1: 1727-3149-1-ND; Quantity Override: 1
U4 = MIC8841: Manufacturer 1: Microchip Technology; Description_: MCHP INTERFACE 2/3-Port EtherCAT Slave Controller LAN9254 TQFP80; Dev Tools Status: Design; Owner: Manikandan Balakrishnan; Populated: YES; MCHP-ID: MIC8841; Symbol: LAN9254-SVB TQFP80; Type: Ethernet; Status: MCL Design; Revision: A; Category: MCHP-Interface; ComponentLink1Description: SVN Datasheet; ComponentLink2Description: Local Datasheet; ComponentLink3URL: C:\ALTIUM_WORK\00001_MCHP-CDB\Library\LibraryRefs\LAN9254-SVB TQFP80.SchLib; ComponentLink3Description: Open Symbol; ComponentLink4URL: C:\ALTIUM_WORK\00001_MCHP-CDB\Library\Footprints\TQFP-80_12x12_EP6x6.PcbLib; ComponentLink4Description: Open Footprint; ComponentLink5Description: Open Footprint 2; ComponentLink6Description: Open Footprint 3; ComponentLink7URL: C:\ALTIUM_WORK\00001_MCHP-CDB\Library\Footprints\TQFP-80_12x12_EP6x6_SOCKET.PcbLib; ComponentLink7Description: Open Footprint 4; Manufacturer Part Number 1: LAN9254; Supplier 1: Microchip Technology; Supplier Part Number 1: LAN9254; Quantity Override: 1
Y1 = OSC1212: Manufacturer 1: Murata Electronics North America; Manufacturer Part Number 1: XRCGB25M000F3A00R0; Description_: CRYSTAL 25Mhz 6pF SMD L2.0W1.6H0.7; Dev Tools Status: Design; Owner: Sam Charles; Tolerance: ±35ppm; Load Capacitance: 6pF; Populated: YES; MCHP-ID: OSC1212; Revision: 1; Symbol: Crystal 4 Pins; Status: MCL Design; ComponentLink1URL: https://chn-vm-apps.microchip.com/mchprepo/parts/Datasheets/VPPT-HCRJ126-D.pdf; ComponentLink1Description: SVN Datasheet; ComponentLink2URL: C:\ALTIUM_WORK\00001_MCHP-CDB\Datasheets\VPPT-HCRJ126-D.pdf; ComponentLink2Description: Local Datasheet; ComponentLink3URL: C:\ALTIUM_WORK\00001_MCHP-CDB\Library\LibraryRefs\Crystal 4 Pins.SchLib; ComponentLink3Description: Open Symbol; ComponentLink4URL: C:\ALTIUM_WORK\00001_MCHP-CDB\Library\Footprints\CRYSTAL_XRCGB_L2W1.6H0.7.PcbLib; ComponentLink4Description: Open Footprint; ComponentLink5Description: Open Footprint 2; ComponentLink6Description: Open Footprint 3; ComponentLink7Description: Open Footprint 4; Operating Temperature: -40°C ~ 125°C; Package: SMD-4 L2W1.6H0.7; Type: Crystal; Category: Crystal/Oscillator; Supplier 1: Digi-Key; Supplier Part Number 1: 490-12146-1-ND; Quantity Override: 1
Y2 = OSC1113: Manufacturer 1: AVX Corp/Kyocera Corp; Manufacturer Part Number 1: KC2520B25.0000C10E00; Description_: OSCILLATOR 25MHZ 1.6V-3.63V SMD L2.5W2.0H0.7; Dev Tools Status: Design; Owner: Jamus Griego; Voltage: 1.8-3.3V; Tolerance: ±50ppm; Supply Current: 5mA; MCHP-ID: OSC1113; Revision: A; Symbol: Oscillator 4 Pins; Status: MCL Design; ComponentLink1URL: https://chn-vm-apps.microchip.com/mchprepo/parts/Datasheets/kc2520b_c1_e.pdf; ComponentLink1Description: SVN Datasheet; ComponentLink2URL: C:\ALTIUM_WORK\00001_MCHP-CDB\Datasheets\kc2520b_c1_e.pdf; ComponentLink2Description: Local Datasheet; ComponentLink3URL: C:\ALTIUM_WORK\00001_MCHP-CDB\Library\LibraryRefs\Oscillator 4 Pins.SchLib; ComponentLink3Description: Open Symbol; ComponentLink4URL: C:\ALTIUM_WORK\00001_MCHP-CDB\Library\Footprints\OSCILLATOR_KC2520B-C1.PcbLib; ComponentLink4Description: Open Footprint; ComponentLink5Description: Open Footprint 2; ComponentLink6Description: Open Footprint 3; ComponentLink7Description: Open Footprint 4; Operating Temperature: -10°C ~ 70°C; Package: L2.5W2.0H0.7; Type: Oscillator; Category: Crystal/Oscillator; Supplier 1: Digi-Key; Supplier Part Number 1: 478-4780-1-ND; Quantity Override: 1